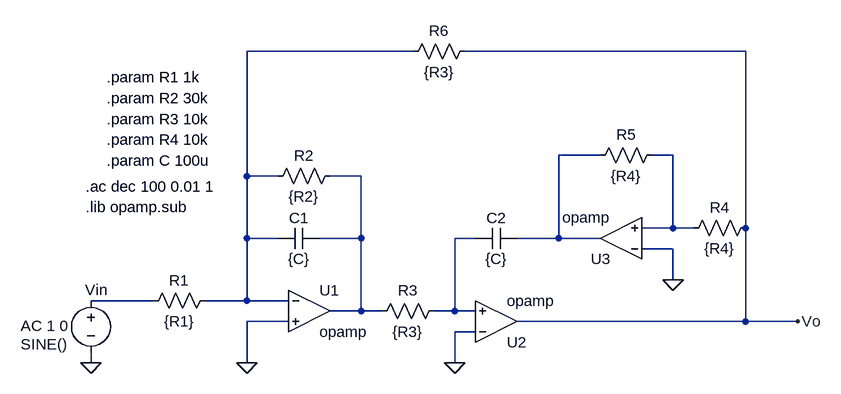
[diagram p0: schematic CircuitoSpicePasabanda.asc]
CircuitoSpicePasabanda.asc, the LTspice schematic file:
Version 4
SHEET 1 880 680
WIRE 176 64 -80 64
WIRE 688 64 256 64
WIRE 464 224 400 224
WIRE 576 224 544 224
WIRE -80 256 -80 64
WIRE -32 256 -80 256
WIRE 96 256 48 256
WIRE 576 336 576 224
WIRE 576 336 528 336
WIRE 608 336 576 336
WIRE 688 336 688 64
WIRE -80 352 -80 256
WIRE -32 352 -80 352
WIRE 96 352 96 256
WIRE 96 352 32 352
WIRE 272 352 240 352
WIRE 400 352 400 224
WIRE 400 352 336 352
WIRE 464 352 400 352
WIRE 576 368 528 368
WIRE 576 416 576 368
WIRE -224 448 -320 448
WIRE -80 448 -80 352
WIRE -80 448 -144 448
WIRE -16 448 -80 448
WIRE 96 464 96 352
WIRE 96 464 48 464
WIRE 128 464 96 464
WIRE 240 464 240 352
WIRE 240 464 208 464
WIRE 272 464 240 464
WIRE -16 480 -80 480
WIRE 688 480 688 336
WIRE 688 480 336 480
WIRE 768 480 688 480
WIRE 272 496 240 496
WIRE -320 544 -320 528
WIRE -80 544 -80 480
WIRE 240 544 240 496
FLAG -80 544 0
FLAG 240 544 0
FLAG 576 416 0
FLAG 768 480 Vo
FLAG -320 544 0
SYMBOL OpAmps\\opamp 16 400 R0
SYMATTR InstName U1
SYMBOL OpAmps\\opamp 304 544 M180
SYMATTR InstName U2
SYMBOL OpAmps\\opamp 496 416 R180
SYMATTR InstName U3
SYMBOL res -128 432 R90
WINDOW 0 0 56 VBottom 2
WINDOW 3 32 56 VTop 2
SYMATTR InstName R1
SYMATTR Value {R1}
SYMBOL res 64 240 R90
WINDOW 0 0 56 VBottom 2
WINDOW 3 32 56 VTop 2
SYMATTR InstName R2
SYMATTR Value {R2}
SYMBOL res 224 448 R90
WINDOW 0 0 56 VBottom 2
WINDOW 3 32 56 VTop 2
SYMATTR InstName R3
SYMATTR Value {R3}
SYMBOL res 704 320 R90
WINDOW 0 0 56 VBottom 2
WINDOW 3 32 56 VTop 2
SYMATTR InstName R4
SYMATTR Value {R4}
SYMBOL res 560 208 R90
WINDOW 0 0 56 VBottom 2
WINDOW 3 32 56 VTop 2
SYMATTR InstName R5
SYMATTR Value {R4}
SYMBOL res 272 48 R90
WINDOW 0 0 56 VBottom 2
WINDOW 3 32 56 VTop 2
SYMATTR InstName R6
SYMATTR Value {R3}
SYMBOL cap 32 336 R90
WINDOW 0 0 32 VBottom 2
WINDOW 3 32 32 VTop 2
SYMATTR InstName C1
SYMATTR Value {C}
SYMBOL cap 336 336 R90
WINDOW 0 0 32 VBottom 2
WINDOW 3 32 32 VTop 2
SYMATTR InstName C2
SYMATTR Value {C}
SYMBOL voltage -320 432 R0
WINDOW 0 -9 -1 Left 2
WINDOW 3 -108 83 Left 2
WINDOW 123 -108 55 Left 2
WINDOW 39 0 0 Left 0
SYMATTR InstName Vin
SYMATTR Value SINE()
SYMATTR Value2 AC 1 0
TEXT -296 104 Left 2 !.param R1 1k
TEXT -296 136 Left 2 !.param R2 30k
TEXT -296 168 Left 2 !.param R3 10k
TEXT -296 232 Left 2 !.param C 100u
TEXT -296 200 Left 2 !.param R4 10k
TEXT -328 272 Left 2 !.ac dec 100 0.01 1
TEXT -328 304 Left 2 !.lib opamp.sub

The netlist it stands for:
* CircuitoSpicePasabanda.asc
XU1 N001 0 N004 opamp Aol=100K GBW=10Meg  ; pins invin noninvin out
XU2 0 N005 Vo opamp Aol=100K GBW=10Meg  ; pins invin noninvin out
XU3 0 N003 N002 opamp Aol=100K GBW=10Meg  ; pins invin noninvin out
R1 N001 N006 {R1}
R2 N004 N001 {R2}
R3 N005 N004 {R3}
R4 Vo N003 {R4}
R5 N003 N002 {R4}
R6 Vo N001 {R3}
C1 N004 N001 {C}
C2 N002 N005 {C}
Vin N006 0 SINE() AC 1 0
.param R1 1k
.param R2 30k
.param R3 10k
.param C 100u
.param R4 10k
.ac dec 100 0.01 1
.lib opamp.sub
.backanno
.end